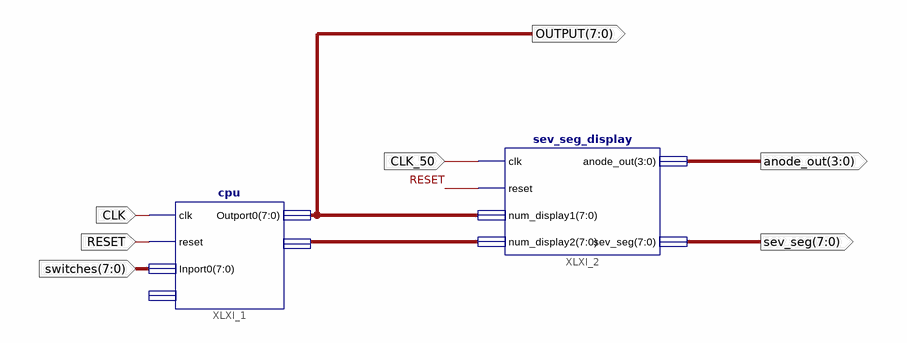
[diagram p0: schematic sheet 1]
// Xilinx ISE schematic toplevel.sch (spartan3e) as structural Verilog: 2 symbols, 7 ports
module toplevel (
  input  CLK,
  input  RESET,
  input  [7:0] switches,
  input  CLK_50,
  output [7:0] OUTPUT,
  output [3:0] anode_out,
  output [7:0] sev_seg
);

  wire [7:0] XLXN_4;

  cpu XLXI_1 (.clk(CLK), .reset(RESET), .Inport0(switches), .Outport0(OUTPUT), .Outport1(XLXN_4));  // open: Inport1
  sev_seg_display XLXI_2 (
    .clk(CLK_50), .reset(RESET), .num_display1(OUTPUT), .num_display2(XLXN_4), .anode_out(anode_out),
    .sev_seg(sev_seg));
endmodule
